# Altium project PCB_Project.PrjPcb
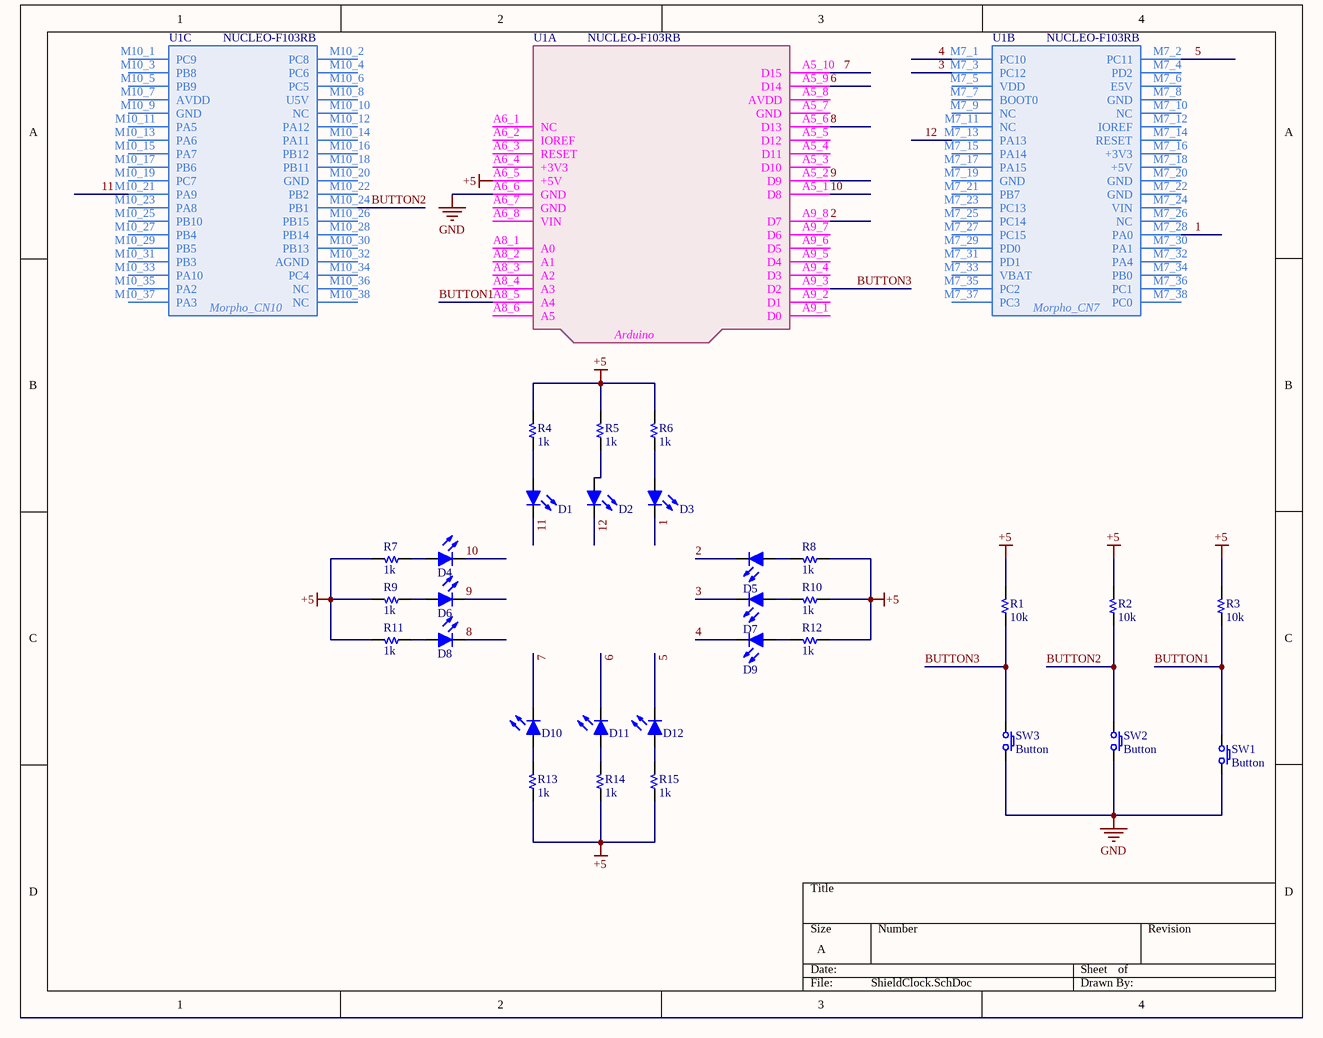
[diagram p0: ShieldClock.SchDoc]
1 sheet, 31 parts. Net scope: global (net labels, ports and power ports of the same name join across sheets).
Board file: ShieldClock.PcbDoc

## Sheet ShieldClock.SchDoc
size A

### Parts
D1  Led  [LED 3MM - red]  (value not drawn)
D2  Led  [LED 3MM - red]  (value not drawn)
D3  Led  [LED 3MM - red]  (value not drawn)
D4  Led  [LED 3MM - red]  (value not drawn)
D5  Led  [LED 3MM - red]  (value not drawn)
D6  Led  [LED 3MM - red]  (value not drawn)
D7  Led  [LED 3MM - red]  (value not drawn)
D8  Led  [LED 3MM - red]  (value not drawn)
D9  Led  [LED 3MM - red]  (value not drawn)
D10  Led  [LED 3MM - red]  (value not drawn)
D11  Led  [LED 3MM - red]  (value not drawn)
D12  Led  [LED 3MM - red]  (value not drawn)
R1  10k  [R 0805]
R2  10k  [R 0805]
R3  10k  [R 0805]
R4  1k  [R 0805]
R5  1k  [R 0805]
R6  1k  [R 0805]
R7  1k  [R 0805]
R8  1k  [R 0805]
R9  1k  [R 0805]
R10  1k  [R 0805]
R11  1k  [R 0805]
R12  1k  [R 0805]
R13  1k  [R 0805]
R14  1k  [R 0805]
R15  1k  [R 0805]
SW1  Button  [SW/2/DIP]
SW2  Button  [SW/2/DIP]
SW3  Button  [SW/2/DIP]
U1  NUCLEO-F103RB  [NUCLEO]  (parts A,B,C of 3)

### Nets
+5: R1.2 R2.2 R3.2 R4.2 R5.2 R6.2 R7.2 R8.1 R9.2 R10.1 R11.2 R12.1 R13.1 R14.1 R15.1 U1.A6_5(+5V)
GND: SW1.2 SW2.2 SW3.2 U1.A6_6(GND)
1: D3.2(K) U1.M7_28(PA0)
2: D5.2(K) U1.A9_8(D7)
3: D7.2(K) U1.M7_3(PC12)
4: D9.2(K) U1.M7_1(PC10)
5: D12.2(K) U1.M7_2(PC11)
6: D11.2(K) U1.A5_9(D14)
7: D10.2(K) U1.A5_10(D15)
8: D8.2(K) U1.A5_6(D13)
9: D6.2(K) U1.A5_2(D9)
10: D4.2(K) U1.A5_1(D8)
11: D1.2(K) U1.M10_21(PA9)
12: D2.2(K) U1.M7_13(PA13)
BUTTON1: R3.1 SW1.1 U1.A8_5(A4)
BUTTON2: R2.1 SW2.1 U1.M10_24(PB1)
BUTTON3: R1.1 SW3.1 U1.A9_3(D2)
NetD1_1: D1.1(A) R4.1
NetD2_1: D2.1(A) R5.1
NetD3_1: D3.1(A) R6.1
NetD4_1: D4.1(A) R7.1
NetD5_1: D5.1(A) R8.2
NetD6_1: D6.1(A) R9.1
NetD7_1: D7.1(A) R10.2
NetD8_1: D8.1(A) R11.1
NetD9_1: D9.1(A) R12.2
NetD10_1: D10.1(A) R13.2
NetD11_1: D11.1(A) R14.2
NetD12_1: D12.1(A) R15.2

Not connected (* = marked no-connect by the designer): U1 A5_3(D10) A5_4(D11) A5_5(D12) A5_7(GND) A5_8(AVDD) A6_1(NC) A6_2(IOREF) A6_3(RESET) A6_4(+3V3) A6_7(GND) A6_8(VIN) A8_1(A0) A8_2(A1) A8_3(A2) A8_4(A3) A8_6(A5) A9_1(D0) A9_2(D1) A9_4(D3) A9_5(D4) A9_6(D5) A9_7(D6) M7_4(PD2) M7_5(VDD) M7_6(E5V) M7_7(BOOT0) M7_8(GND) M7_9(NC) M7_10(NC) M7_11(NC) M7_12(IOREF) M7_14(RESET) M7_15(PA14) M7_16(+3V3) M7_17(PA15) M7_18(+5V) M7_19(GND) M7_20(GND) M7_21(PB7) M7_22(GND) M7_23(PC13) M7_24(VIN) M7_25(PC14) M7_26(NC) M7_27(PC15) M7_29(PD0) M7_30(PA1) M7_31(PD1) M7_32(PA4) M7_33(VBAT) M7_34(PB0) M7_35(PC2) M7_36(PC1) M7_37(PC3) M7_38(PC0) M10_1(PC9) M10_2(PC8) M10_3(PB8) M10_4(PC6) M10_5(PB9) M10_6(PC5) M10_7(AVDD) M10_8(U5V) M10_9(GND) M10_10(NC) M10_11(PA5) M10_12(PA12) M10_13(PA6) M10_14(PA11) M10_15(PA7) M10_16(PB12) M10_17(PB6) M10_18(PB11) M10_19(PC7) M10_20(GND) M10_22(PB2) M10_23(PA8) M10_25(PB10) M10_26(PB15) M10_27(PB4) M10_28(PB14) M10_29(PB5) M10_30(PB13) M10_31(PB3) M10_32(AGND) M10_33(PA10) M10_34(PC4) M10_35(PA2) M10_36(NC) M10_37(PA3) M10_38(NC)

### Notes on the sheet
- (in symbol NUCLEO-F103RB, part A) Arduino
- (in symbol NUCLEO-F103RB, part B) Morpho_CN7
- (in symbol NUCLEO-F103RB, part C) Morpho_CN10

### Library data of the parts
D1-D12 = Led: Typical LED
R1-R15 = Resistor
SW1-SW3 = SW SPST: Tact switch 2 pin
U1 = NUCLEO-F103RB: STM32F103RB, mbed-Enabled Development Nucleo-64 STM32F1 ARM® Cortex®-M3 MCU 32-Bit Embedded Evaluation Board; Manufacturer: STMicroelectronics; Manufacturer Product Number: NUCLEO-F103RB; BRAND: STMicroelectronics; PART NO: NUCLEO-F103RB; STOCK CODE: 497-14362-ND; SUPPLIER: digi-key; TYPE: EVAL BRD